# Altium schematic sheet obc-v2_TMP-eMMC.SchDoc
size 420 x 297 mm; SheetNumber: 6; SheetTotal: 23
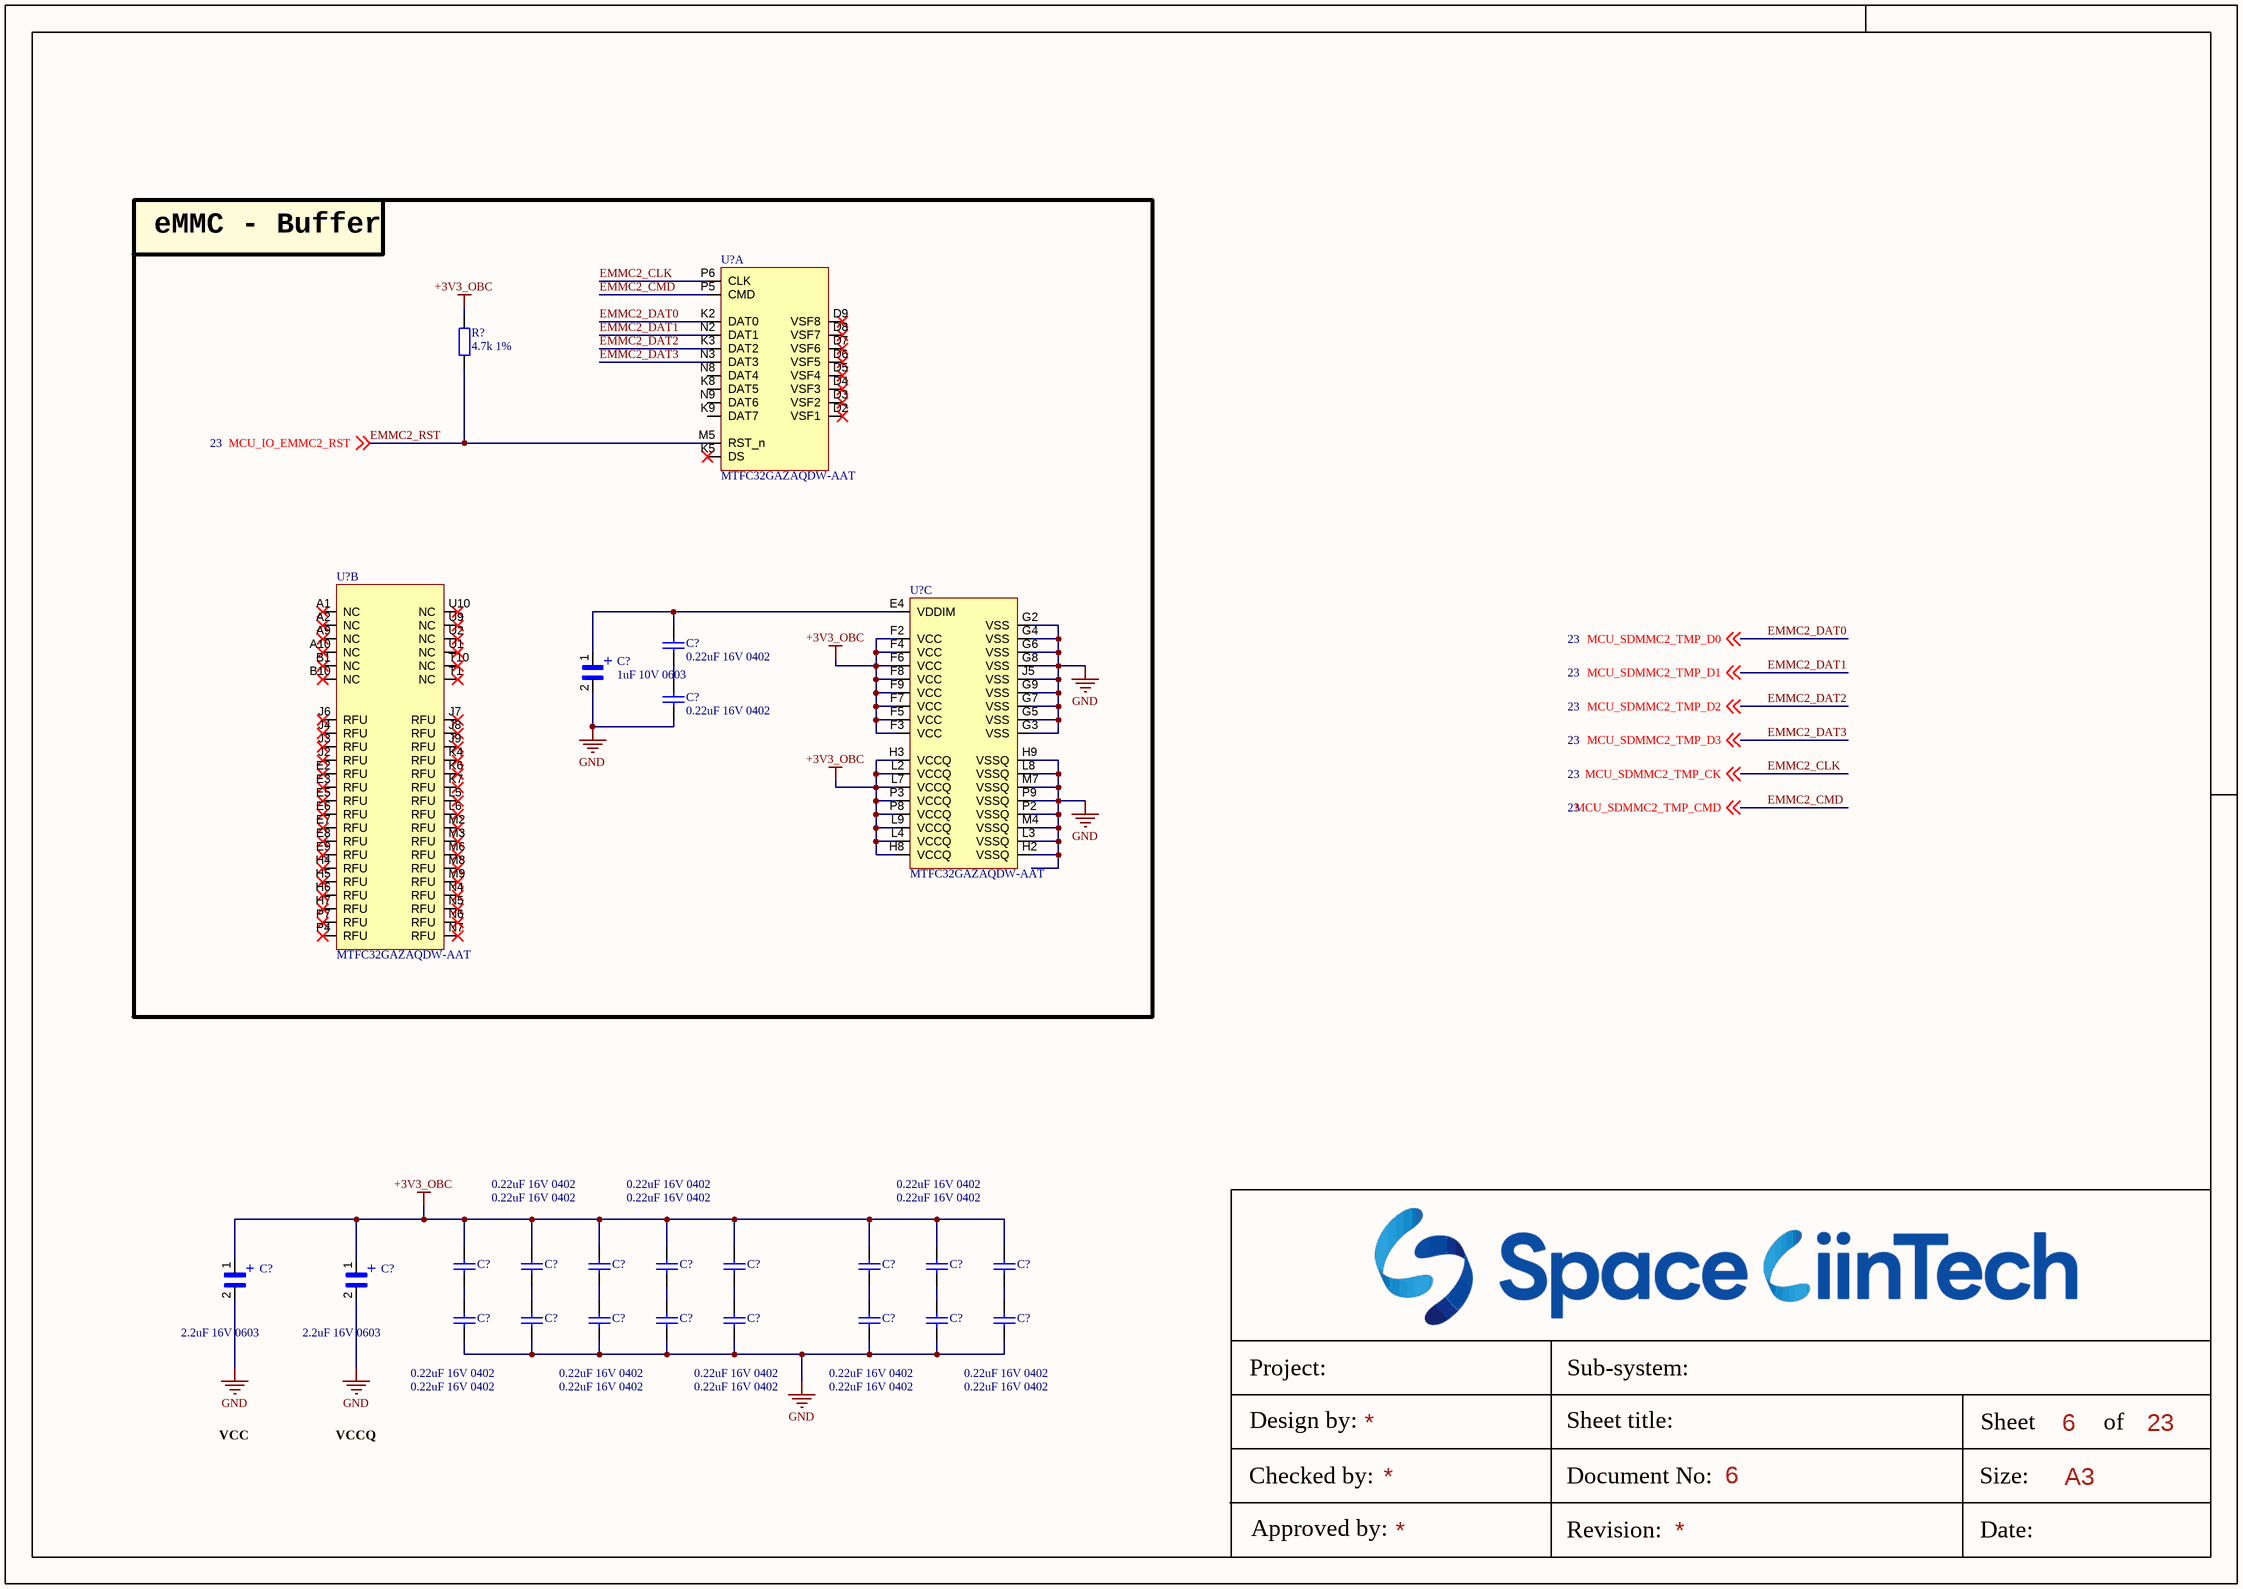
[diagram p0: obc-v2_TMP-eMMC.SchDoc]

## Parts
(Parts that share a designator on the sheet are numbered #1, #2 ... from top to bottom, then left to right.)
C?#1  0.22uF 16V 0402  [tu 0402]
C?#2  1uF 10V 0603  [CAPC1608X90]
C?#3  0.22uF 16V 0402  [tu 0402]
C?#4  0.22uF 16V 0402  [tu 0402]
C?#5  0.22uF 16V 0402  [tu 0402]
C?#6  0.22uF 16V 0402  [tu 0402]
C?#7  0.22uF 16V 0402  [tu 0402]
C?#8  0.22uF 16V 0402  [tu 0402]
C?#9  0.22uF 16V 0402  [tu 0402]
C?#10  0.22uF 16V 0402  [tu 0402]
C?#11  0.22uF 16V 0402  [tu 0402]
C?#12  2.2uF 16V 0603  [CAPC1608X90]
C?#13  2.2uF 16V 0603  [CAPC1608X90]
C?#14  0.22uF 16V 0402  [tu 0402]
C?#15  0.22uF 16V 0402  [tu 0402]
C?#16  0.22uF 16V 0402  [tu 0402]
C?#17  0.22uF 16V 0402  [tu 0402]
C?#18  0.22uF 16V 0402  [tu 0402]
C?#19  0.22uF 16V 0402  [tu 0402]
C?#20  0.22uF 16V 0402  [tu 0402]
C?#21  0.22uF 16V 0402  [tu 0402]
R?  4.7k 1%  [tro smd 0603]
U?#1  MTFC32GAZAQDW-AAT  (part A of 3)
U?#2  MTFC32GAZAQDW-AAT  (part C of 3)
U?#3  MTFC32GAZAQDW-AAT  (part B of 3)

## Blocks framed on the sheet
eMMC - Buffer: C?#1-C?#3 R? U?#1-U?#3

## Nets
+3V3_OBC: C?#4.1 C?#5.1 C?#6.1 C?#7.1 C?#8.1 C?#9.1 C?#10.1 C?#11.1 C?#12.1 C?#13.1 R?.1 U?#2.F2(VCC) U?#2.F3(VCC) U?#2.F4(VCC) U?#2.F5(VCC) U?#2.F6(VCC) U?#2.F7(VCC) U?#2.F8(VCC) U?#2.F9(VCC) U?#2.H3(VCCQ) U?#2.H8(VCCQ) U?#2.L2(VCCQ) U?#2.L4(VCCQ) U?#2.L7(VCCQ) U?#2.L9(VCCQ) U?#2.P3(VCCQ) U?#2.P8(VCCQ)
GND: C?#2.2 C?#3.2 C?#12.2 C?#13.2 C?#14.2 C?#15.2 C?#16.2 C?#17.2 C?#18.2 C?#19.2 C?#20.2 C?#21.2 U?#2.G2(VSS) U?#2.G3(VSS) U?#2.G4(VSS) U?#2.G5(VSS) U?#2.G6(VSS) U?#2.G7(VSS) U?#2.G8(VSS) U?#2.G9(VSS) U?#2.H2(VSSQ) U?#2.H9(VSSQ) U?#2.J5(VSS) U?#2.L3(VSSQ) U?#2.L8(VSSQ) U?#2.M4(VSSQ) U?#2.M7(VSSQ) U?#2.P2(VSSQ) U?#2.P9(VSSQ)
EMMC2_CLK: U?#1.P6(CLK) ; off-sheet MCU_SDMMC2_TMP_CK  [also labelled MCU_SDMMC2_TMP_CK]
EMMC2_CMD: U?#1.P5(CMD) ; off-sheet MCU_SDMMC2_TMP_CMD  [also labelled MCU_SDMMC2_TMP_CMD]
EMMC2_DAT0: U?#1.K2(DAT0) ; off-sheet MCU_SDMMC2_TMP_D0  [also labelled MCU_SDMMC2_TMP_D0]
EMMC2_DAT1: U?#1.N2(DAT1) ; off-sheet MCU_SDMMC2_TMP_D1  [also labelled MCU_SDMMC2_TMP_D1]
EMMC2_DAT2: U?#1.K3(DAT2) ; off-sheet MCU_SDMMC2_TMP_D2  [also labelled MCU_SDMMC2_TMP_D2]
EMMC2_DAT3: U?#1.N3(DAT3) ; off-sheet MCU_SDMMC2_TMP_D3  [also labelled MCU_SDMMC2_TMP_D3]
EMMC2_RST: R?.2 U?#1.M5(RST_n) ; off-sheet MCU_IO_EMMC2_RST  [also labelled MCU_IO_EMMC2_RST]
NetC?#1_1: C?#1.1 C?#2.1 U?#2.E4(VDDIM)
NetC?#1_2: C?#1.2 C?#3.1
NetC?#4_2: C?#4.2 C?#14.1
NetC?#5_2: C?#5.2 C?#15.1
NetC?#6_2: C?#6.2 C?#16.1
NetC?#7_2: C?#7.2 C?#17.1
NetC?#8_2: C?#8.2 C?#18.1
NetC?#9_2: C?#9.2 C?#19.1
NetC?#10_2: C?#10.2 C?#20.1
NetC?#11_2: C?#11.2 C?#21.1

Not connected (* = marked no-connect by the designer): U?#1 D2(VSF1)* D3(VSF2)* D4(VSF3)* D5(VSF4)* D6(VSF5)* D7(VSF6)* D8(VSF7)* D9(VSF8)* K5(DS)* K8(DAT5) K9(DAT7) N8(DAT4) N9(DAT6); U?#3 A1(NC)* A2(NC)* A9(NC)* A10(NC)* B1(NC)* B10(NC)* E2(RFU)* E3(RFU)* E5(RFU)* E6(RFU)* E7(RFU)* E8(RFU)* E9(RFU)* H4(RFU)* H5(RFU)* H6(RFU)* H7(RFU)* J2(RFU)* J3(RFU)* J4(RFU)* J6(RFU)* J7(RFU)* J8(RFU)* J9(RFU)* K4(RFU)* K6(RFU)* K7(RFU)* L5(RFU)* L6(RFU)* M2(RFU)* M3(RFU)* M6(RFU)* M8(RFU)* M9(RFU)* N4(RFU)* N5(RFU)* N6(RFU)* N7(RFU)* P4(RFU)* P7(RFU)* T1(NC)* T10(NC)* U1(NC)* U2(NC)* U9(NC)* U10(NC)*

## Notes on the sheet
- VCC
- VCCQ
- Project:
- Sub-system:
- Design by:
- Sheet title:
- Sheet
- A3
- of
- Checked by:
- Approved by:
- Revision:
- Document No:
- Size:
- Date:
- (in symbol TACL335M003RTA) +

## Library data of the parts
C?#1 C?#3-C?#11 C?#14-C?#21 = Tu 0402 33nF 10V: 0.22 µF ±10% 16V Ceramic Capacitor X7R 0402 (1005 Metric): GCM155R71C224KE02D; Chung_Loai: Dán; Don_Vi: Con; So_Chan: 2; Ten_Linh_Kien: Tụ 0402 33nF X7R 10V GRM155R71A333KA01D; Ma_Hang: MH007853; Kieu_Chan: *
C?#2 = TACL335M003RTA: 1 µF Molded Tantalum Capacitors 10 V 0603 (1608 Metric) 12Ohm @ 100kHz: TP8M105M010C; Package: None; Price: None; Value: *; MP: TACL335M003RTA; Availability: Unavailable
C?#12 C?#13 = TACL335M003RTA: 2.2 µF Molded Tantalum Capacitors 16 V 0603 (1608 Metric) 12Ohm @ 100kHz: TP8M225M016C; Package: None; Price: None; Value: *; MP: TACL335M003RTA; Availability: Unavailable
R? = Tro 0603 1% 10k: RES 4.7K OHM 1% 1/10W 0603, P/N: ERJ-U03F4701V; Chung_Loai: Dán; Don_Vi: Con; So_Chan: 2; Ten_Linh_Kien: Trở 0603 1% 10k; Ma_Hang: MH006333; Kieu_Chan: *